# EAGLE design G2-CAPE (EAGLE 7.2.0)
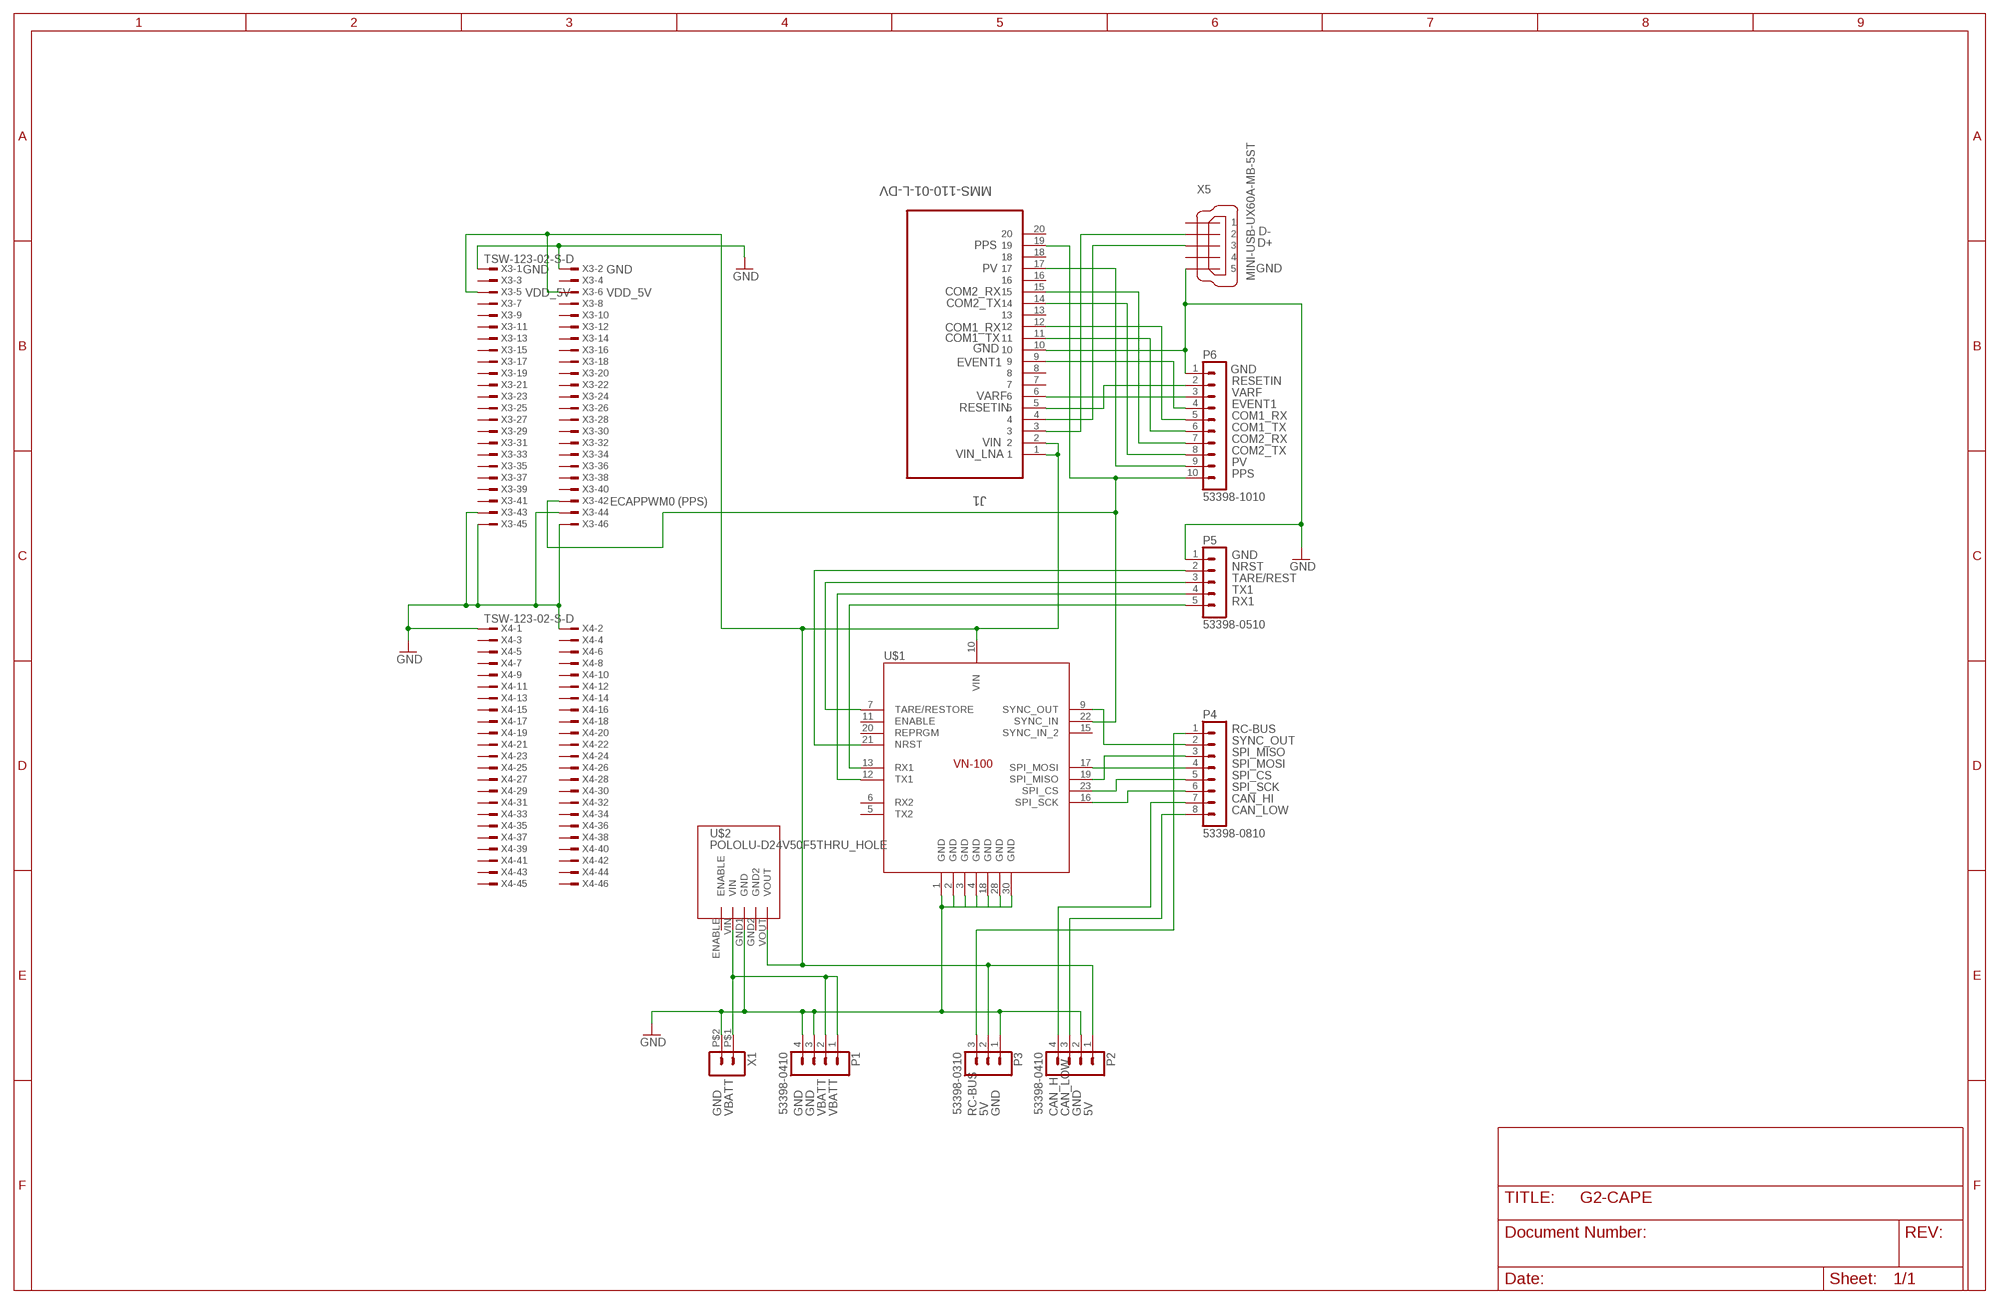
[diagram p0: schematic, sheet 1]

## Parts
J1  MMS-110-01-L-DV  [SAMTEC_MMS-110-01-L-DV]
P1  53398-0410  [53398-0410]
P2  53398-0410  [53398-0410]
P3  53398-0310  [53398-0310]
P4  53398-0810  [53398-0810]
P5  53398-0510  [53398-0510]
P6  53398-1010  [53398-1010]
U$1  VN100NORMAL  [7X8CASTLE]
U$2  POLOLU-D24V50F5THRU_HOLE  [POLOLU-D24V50F5]
X1  HEADER_POS2_  [43650-0203]
X3  TSW-123-02-S-D  [TSW-123-02-S-D]
X4  TSW-123-02-S-D  [TSW-123-02-S-D]
X5  MINI-USB-UX60A-MB-5ST  [UX60A-MB-5ST]

## Nets
GND: J1.10 P1.3 P1.4 P2.2 P3.1 P5.1 P6.1 U$1.1(GND) U$1.2(GND) U$1.3(GND) U$1.4(GND) U$1.18(GND) U$1.28(GND) U$1.30(GND) U$2.GND1(GND) X1.P$2 X3.1 X3.2 X3.43 X3.44 X3.45 X3.46 X4.1 X4.2 X5.5
N$1: P1.1 P1.2 U$2.VIN X1.P$1
N$2: J1.19 P6.10 U$1.22(SYNC_IN) X3.42
N$3: J1.1 J1.2 P2.1 P3.2 U$1.10(VIN) U$2.VOUT X3.5 X3.6
N$4: P5.5 U$1.13(RX1)
N$5: P3.3 P4.1
N$6: P2.3 P4.8
N$7: P2.4 P4.7
N$8: P5.4 U$1.12(TX1)
N$9: P4.2 U$1.9(SYNC_OUT)
N$10: P4.3 U$1.19(SPI_MISO)
N$11: P5.3 U$1.7(TARE/RESTORE)
N$12: P5.2 U$1.21(NRST)
N$13: J1.3 X5.2
N$14: P4.4 U$1.17(SPI_MOSI)
N$15: P4.5 U$1.23(SPI_CS)
N$16: P4.6 U$1.16(SPI_SCK)
N$20: J1.4 X5.3
N$21: J1.5 P6.2
N$23: J1.6 P6.3
N$24: J1.9 P6.4
N$25: J1.12 P6.5
N$26: J1.11 P6.6
N$27: J1.15 P6.7
N$28: J1.14 P6.8
N$29: J1.17 P6.9
Unconnected: J1.7 J1.8 J1.13 J1.16 J1.18 J1.20 U$1.5(TX2) U$1.6(RX2) U$1.11(ENABLE) U$1.15(SYNC_IN_2) U$1.20(REPRGM) U$2.ENABLE U$2.GND2 X3.3 X3.4 X3.7 X3.8 X3.9 X3.10 X3.11 X3.12 X3.13 X3.14 X3.15 X3.16 X3.17 X3.18 X3.19 X3.20 X3.21 X3.22 X3.23 X3.24 X3.25 X3.26 X3.27 X3.28 X3.29 X3.30 X3.31 X3.32 X3.33 X3.34 X3.35 X3.36 X3.37 X3.38 X3.39 X3.40 X3.41 X4.3 X4.4 X4.5 X4.6 X4.7 X4.8 X4.9 X4.10 X4.11 X4.12 X4.13 X4.14 X4.15 X4.16 X4.17 X4.18 X4.19 X4.20 X4.21 X4.22 X4.23 X4.24 X4.25 X4.26 X4.27 X4.28 X4.29 X4.30 X4.31 X4.32 X4.33 X4.34 X4.35 X4.36 X4.37 X4.38 X4.39 X4.40 X4.41 X4.42 X4.43 X4.44 X4.45 X4.46 X5.1 X5.4

## Notes on the sheet
- D-
- PPS | D+
- GND | GND | PV | GND
- VDD_5V | VDD_5V | COM2_RX
- COM2_TX
- COM1_RX
- COM1_TX
- GND
- EVENT1
- GND
- RESETIN
- VARF
- VARF
- EVENT1
- RESETIN
- COM1_RX
- COM1_TX
- COM2_RX
- VIN
- COM2_TX
- VIN_LNA
- PV
- PPS
- ECAPPWM0 (PPS)
- GND
- NRST
- TARE/REST
- TX1
- RX1
- RC-BUS
- SYNC_OUT
- SPI_MISO
- SPI_MOSI
- SPI_CS
- SPI_SCK
- CAN_HI
- CAN_LOW
- GND | VBATT | GND | GND | VBATT | VBATT | RC-BUS | 5V | GND | CAN_HI | CAN_LOW | GND | 5V

## Library data of the parts
J1 = SAMTEC-FLE-Mxx-Sxx_By_element14_Batch_1:MMS-110-01-L-DV: CONN RECEPTACLE, 2MM, VERT, 20WAY; MPN: MMS-110-01-L-DV; OC_FARNELL: 1667856; OC_NEWARK: 11P5392; PACKAGE: RECEPTACLE, 2MM, VERT, 20WAY; SUPPLIER: Samtec
P1 P2 = con-molex-picoblade:53398-0410: HEADER
P3 = con-molex-picoblade:53398-0310: HEADER
P4 = con-molex-picoblade:53398-0810: HEADER
P5 = con-molex-picoblade:53398-0510: HEADER
P6 = con-molex-picoblade:53398-1010: HEADER
U$1 = vectornav:VN100: VectorNav VN-100(T) Inertial Measurement Unit (IMU) and Attitude Heading Reference System (AHRS).
U$2 = pololu-D24V50F5:POLOLU-D24V50F5
X1 = con-molex-micro-fit-3_0:HEADER_POS2_?: Molex - Micro-Fit 3.0 Series connector, 3.00mm (0.118") pitch header, 2 positions.
X3 X4 = con-samtec:TSW-123-02-S-D: THROUGH-HOLE .025" SQ POST HEADER Source: Samtec TSW.pdf; OC_FARNELL: unknown; OC_NEWARK: unknown
X5 = con-hirose:MINI-USB-: MINI USB Connector Source: http://www.hirose.co.jp/cataloge_hp/e24000019.pdf; OC_FARNELL: unknown; OC_NEWARK: unknown

## Net classes
0 default: width 0.254 mm, drill 0.584 mm, clearance 0.254 mm

## Board
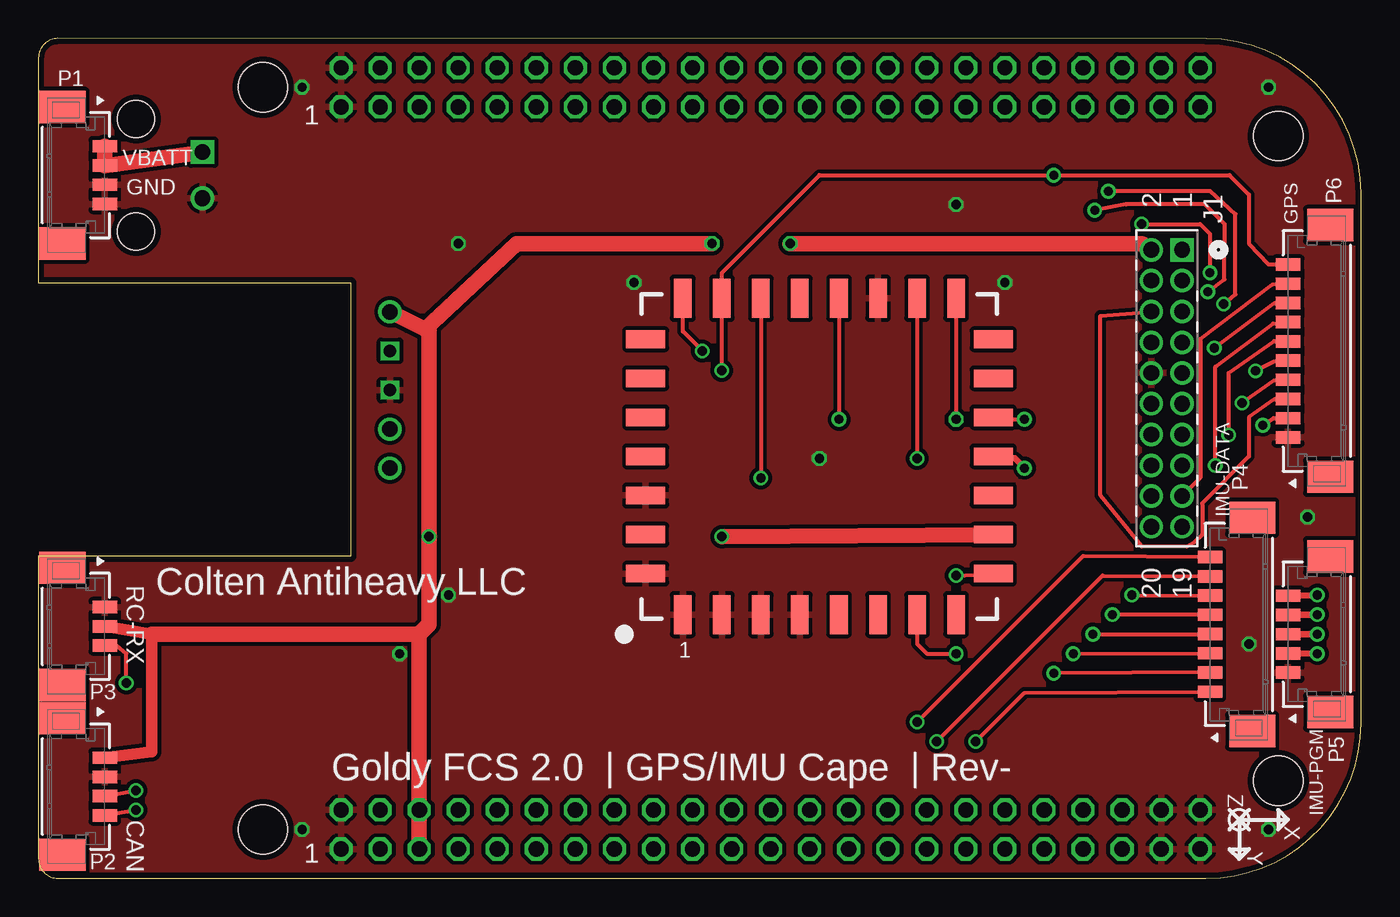
[diagram p1: board, top side]
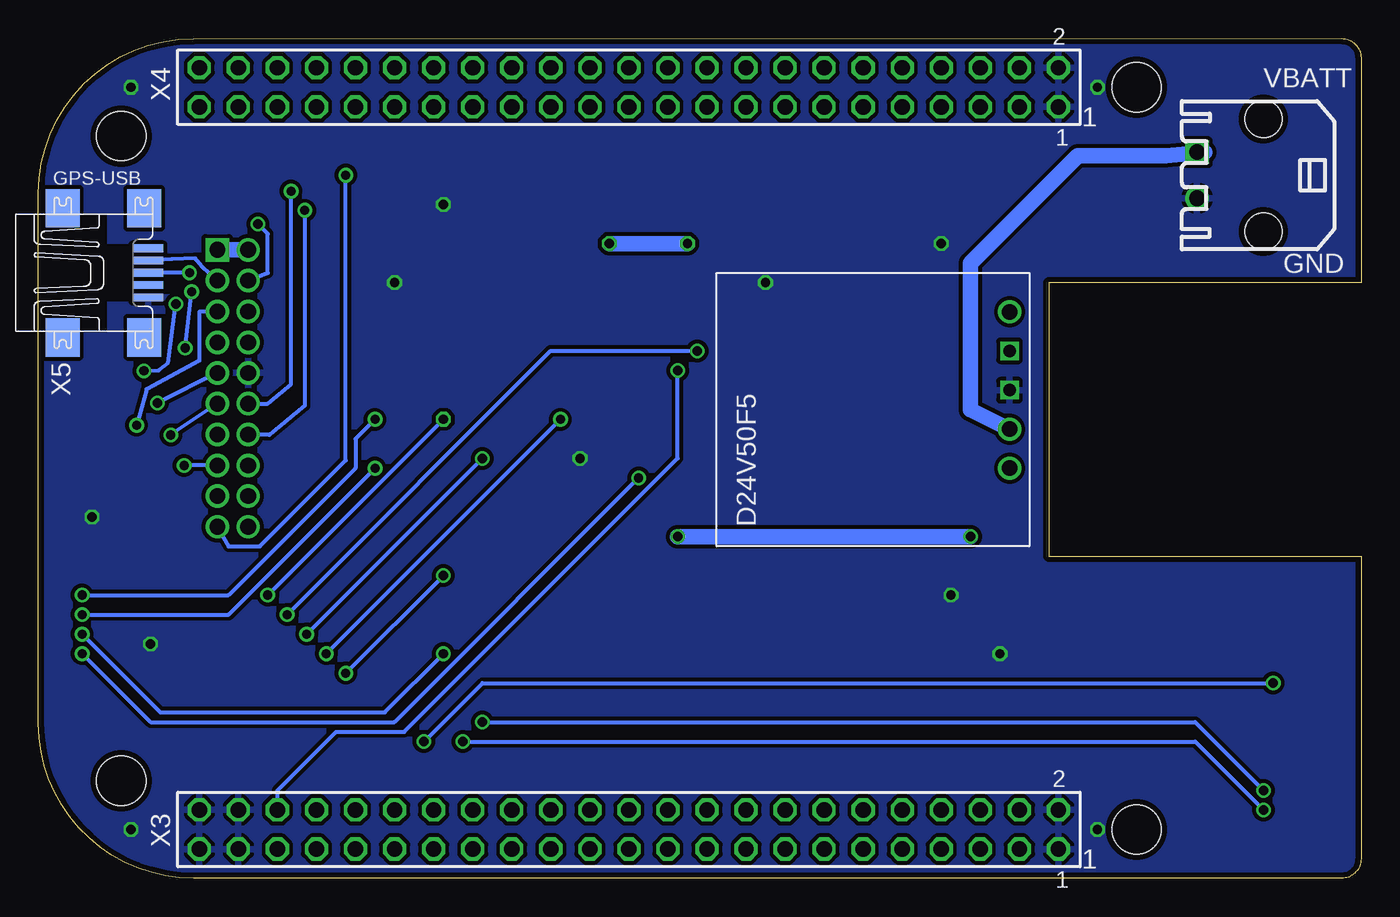
[diagram p2: board, bottom side, seen from below]

Size 86.03 x 54.61 mm. Coordinates in mm from the lower left corner, seen from the top.
Outline: 0,20.95 0,1.27 arc90 1.27,0 75.95,0 arc90 86.03,10.08 86.03,44.53 arc90 75.96,54.6 1.27,54.61 arc90 0,53.34 0,38.73 20.32,38.73 20.32,20.95 0,20.95
Copper layers (1*16): Top 0.0356mm / dielectric 1.5011mm / Bottom 0.0356mm
Design rules "oshpark-2layer *": minimum track width 6mil, minimum drill 13mil, track to track 6mil, track to pad 6mil, pad to pad 6mil, via to via 6mil, smd to smd 6mil, copper to edge 15mil, drill to drill 6mil, minimum pad ring 7mil, minimum via ring 7mil, stop-mask expansion 4mil, vias tented up to drill 25mil, thermal gap 10mil
Holes 3.2 mm at 14.61,3.17 14.61,51.44 80.64,6.35 80.64,48.26

### Footprints (pad centres in the part's own frame; a part is rotated, then mirrored left to right if it is on the bottom)
SAMTEC_MMS-110-01-L-DV = drill 1.016 square: 1 18.009,-2.007 | drill 1.016: 2 18.009,0; 3 16.002,-2.007; 4 16.002,0; 5 13.995,-2.007; 6 13.995,0; 7 11.989,-2.007; 8 11.989,0; 9 10.008,-2.007; 10 10.008,0; 11 8.001,-2.007; 12 8.001,0; 13 5.994,-2.007; 14 5.994,0; 15 3.988,-2.007; 16 3.988,0; 17 2.007,-2.007; 18 2.007,0; 19 0,-2.007; 20 0,0
53398-0410 = smd 0.8 x 1.6: 1 1.875,0; 2 0.625,0; 3 -0.625,0; 4 -1.875,0 | smd 2.1 x 3: M1 4.435,2.75; M2 -4.435,2.75
53398-0310 = smd 0.8 x 1.6: 1 1.25,0; 2 0,0; 3 -1.25,0 | smd 2.1 x 3: M1 3.81,2.75; M2 -3.81,2.75
53398-0810 = smd 0.8 x 1.6: 1 4.375,0; 2 3.125,0; 3 1.875,0; 4 0.625,0; 5 -0.625,0; 6 -1.875,0; 7 -3.125,0; 8 -4.375,0 | smd 2.1 x 3: M1 6.935,2.75; M2 -6.935,2.75
53398-0510 = smd 0.8 x 1.6: 1 2.5,0; 2 1.25,0; 3 0,0; 4 -1.25,0; 5 -2.5,0 | smd 2.1 x 3: M1 5.06,2.75; M2 -5.06,2.75
53398-1010 = smd 0.8 x 1.6: 1 5.625,0; 2 4.375,0; 3 3.125,0; 4 1.875,0; 5 0.625,0; 6 -0.625,0; 7 -1.875,0; 8 -3.125,0; 9 -4.375,0; 10 -5.625,0 | smd 2.1 x 3: M1 8.185,2.75; M2 -8.185,2.75
7X8CASTLE = smd 2.54 x 1.143: 1 10.16,-8.89; 2 10.16,-6.35; 3 10.16,-3.81; 4 10.16,-1.27; 5 10.16,1.27; 6 10.16,3.81; 7 10.16,6.35; 8 10.16,8.89; 16 -10.414,8.89; 17 -10.414,6.35; 18 -10.414,3.81; 19 -10.414,1.27; 20 -10.414,-1.27; 21 -10.414,-3.81; 22 -10.414,-6.35; 23 -10.414,-8.89 | smd 1.143 x 2.54: 9 7.493,11.303; 10 4.953,11.303; 11 2.413,11.303; 12 -0.127,11.303; 13 -2.667,11.303; 14 -5.207,11.303; 15 -7.747,11.303; 24 -7.747,-11.303; 25 -5.207,-11.303; 26 -2.667,-11.303; 27 -0.127,-11.303; 28 2.413,-11.303; 29 4.953,-11.303; 30 7.493,-11.303
POLOLU-D24V50F5 = drill 1: ENABLE 0,0; VIN 2.54,0; VOUT 10.16,0 | drill 0.8 square: GND1 5.08,0; GND2 7.62,0
43650-0203 = drill 1.02 square: P$1 1.5,4.32 | drill 1.02: P$2 -1.5,4.32 | hole 2.413: 3.658,0; -3.658,0
TSW-123-02-S-D = drill 1 pad 1.5 octagon: 1 27.94,-1.27; 2 27.94,1.27; 3 25.4,-1.27; 4 25.4,1.27; 5 22.86,-1.27; 6 22.86,1.27; 7 20.32,-1.27; 8 20.32,1.27; 9 17.78,-1.27; 10 17.78,1.27; 11 15.24,-1.27; 12 15.24,1.27; 13 12.7,-1.27; 14 12.7,1.27; 15 10.16,-1.27; 16 10.16,1.27; 17 7.62,-1.27; 18 7.62,1.27; 19 5.08,-1.27; 20 5.08,1.27; 21 2.54,-1.27; 22 2.54,1.27; 23 0,-1.27; 24 0,1.27; 25 -2.54,-1.27; 26 -2.54,1.27; 27 -5.08,-1.27; 28 -5.08,1.27; 29 -7.62,-1.27; 30 -7.62,1.27; 31 -10.16,-1.27; 32 -10.16,1.27; 33 -12.7,-1.27; 34 -12.7,1.27; 35 -15.24,-1.27; 36 -15.24,1.27; 37 -17.78,-1.27; 38 -17.78,1.27; 39 -20.32,-1.27; 40 -20.32,1.27; 41 -22.86,-1.27; 42 -22.86,1.27; 43 -25.4,-1.27; 44 -25.4,1.27; 45 -27.94,-1.27; 46 -27.94,1.27
UX60A-MB-5ST = smd 2 x 0.5: 1 2.25,1.6; 2 2.25,0.8; 3 2.25,0; 4 2.25,-0.8; 5 2.25,-1.6 | smd 2.2 x 2.5: M1 -3.3,-4.2; M2 -3.3,4.2; M3 2,4.2; M4 2,-4.2

### Placement (x,y rotation side)
J1  72.39,22.86 90 top
P1  4.32,45.72 90 top
P2  4.32,5.97 90 top
P3  4.32,16.38 90 top
P4  76.2,16.51 270 top
P5  81.28,15.88 270 top
P6  81.28,34.29 270 top
U$1  50.8,27.3 270 top
U$2  22.86,26.67 90 bottom
X1  6.35,45.72 90 bottom
X3  47.62,3.17 0 bottom
X4  47.62,51.44 0 bottom
X5  81.15,39.37 0 bottom

### Tracks (layer width: path | path; a pad name or v marks a point on that pad's centre or on a via)
GND  (via drill 0.6)
  other vias: 82.55,23.5 80.01,3.17 80.01,51.44 17.14,51.44 17.14,3.17 50.8,27.3 26.67,18.41 27.3,41.27 38.73,38.73 78.74,15.24 59.69,43.81 23.5,14.61 62.87,38.73
  pour Top: -1.27,55.88 -1.27,-1.27 87.63,-1.27 87.63,55.88
  pour Bottom: -1.27,55.88 87.63,55.88 87.63,-1.27 -1.27,-1.27
N$1
  Top 1.016: P1.1 P1.2 X1.P$1
  Bottom 0.61: 10.16,47.22 X1.P$1
  Bottom 1.016: U$2.VIN 25.4,30.48 25.4,40.01 18.41,46.99 12.7,46.99 10.16,47.22
N$2  (via drill 0.6)
  Top 0.254: P6.10 80.01,39.91 78.74,41.27 78.74,44.45 77.47,45.72 v66.04,45.72 50.8,45.72 44.45,39.37 U$1.22 v44.45,33.02
  Bottom 0.254: J1.19 73.66,21.59 71.63,21.59 66.04,27.18 v66.04,45.72 | X3.42 70.48,5.71 66.67,9.53 62.23,9.53 44.45,27.3 v44.45,33.02
N$3  (via drill 0.6)
  Top 0.762: P2.1 7.37,8.22 7.37,15.88 P3.2
  Top 1.016: 7.37,15.88 24.77,15.88 | 24.77,15.88 25.4,16.51 v25.4,22.23 25.4,35.56 25.15,35.69 | 25.15,35.69 U$2.VOUT | U$1.10 v44.45,22.23 | J1.2 71.75,41.27 v48.9,41.27 | v43.81,41.27 31.11,41.27 25.15,35.69 | X3.5 X3.6 24.77,15.88
  Bottom 1.016: J1.1 J1.2 | v25.4,22.23 v44.45,22.23 | v48.9,41.27 v43.81,41.27
N$4  (via drill 0.6)
  Top 0.254: 62.87,29.84 v64.14,29.84
  Top 0.406: P5.5 v83.19,18.41 | U$1.13 62.87,29.84
  Bottom 0.254: v83.19,18.41 73.66,18.41 65.41,26.67 65.41,28.57 v64.14,29.84
N$5  (via drill 0.6, 0.61)
  Top 0.254: v5.71,12.7 5.71,14.61 5.08,15.11 P3.3 | v60.96,8.89 64.14,12.06 P4.1
  Bottom 0.254: v5.71,12.7 57.15,12.7 v60.96,8.89
N$6  (via drill 0.6)
  Top 0.254: P2.3 v6.35,5.71 | v57.15,10.16 67.94,20.95 P4.8
  Bottom 0.254: v57.15,10.16 10.79,10.16 v6.35,5.71
N$7  (via drill 0.6)
  Top 0.254: P2.4 v6.35,4.45 | v58.42,8.89 69.22,19.68 P4.7
  Bottom 0.254: v58.42,8.89 10.79,8.89 v6.35,4.45
N$8  (via drill 0.6)
  Top 0.406: P5.4 v83.19,17.14 | U$1.12 63.5,27.3 v64.14,26.67
  Bottom 0.254: v83.19,17.14 73.66,17.14 v64.14,26.67
N$9  (via drill 0.6)
  Top 0.254: P4.2 v66.04,13.34 | v59.69,19.68 U$1.9
  Bottom 0.254: v66.04,13.34 v59.69,19.68
N$10  (via drill 0.6)
  Top 0.254: U$1.19 v52.07,29.84 | v67.31,14.61 P4.3
  Bottom 0.254: v52.07,29.84 v67.31,14.61
N$11  (via drill 0.6)
  Top 0.254: U$1.7 57.15,15.24 57.78,14.61 v59.69,14.61
  Top 0.406: P5.3 v83.19,15.88
  Bottom 0.254: v83.19,15.88 78.11,10.79 63.5,10.79 v59.69,14.61
N$12  (via drill 0.6)
  Top 0.254: U$1.21 v46.99,26.04
  Top 0.406: P5.2 v83.19,14.61
  Bottom 0.254: v83.19,14.61 78.74,10.16 62.87,10.16 v46.99,26.04
N$13
  Bottom 0.254: J1.3 75.39,39.78 75.84,40.31 77.34,40.26 X5.2
N$14  (via drill 0.6)
  Top 0.254: U$1.17 v57.15,27.3 | v68.58,15.88 P4.4
  Bottom 0.254: v57.15,27.3 v68.58,15.88
N$15  (via drill 0.6)
  Top 0.254: P4.5 v69.85,17.14 | v43.18,34.29 41.91,35.56 U$1.23
  Bottom 0.254: v69.85,17.14 52.7,34.29 v43.18,34.29
N$16  (via drill 0.6)
  Top 0.254: U$1.16 v59.69,29.84 | v71.12,18.41 P4.6
  Bottom 0.254: v59.69,29.84 v71.12,18.41
N$20  (via drill 0.6)
  Top 0.254: v71.75,42.55 75.56,42.55 76.2,41.91 v76.2,39.37
  Bottom 0.254: J1.4 71.12,39.37 71.12,41.91 v71.75,42.55 | v76.2,39.37 X5.3
N$21  (via drill 0.6)
  Top 0.254: v79.64,29.46 80.34,29.92 P6.2
  Bottom 0.254: J1.5 75.56,36.83 75.56,33.66 78.99,31.8 v79.64,29.46
N$23
  Top 0.254: P6.3 80.39,31.14 78.74,29.97 78.74,27.43 75.69,24.38 75.69,22.35 75.18,21.84 74.68,21.57 71.75,21.59 69.09,24.89 69.09,36.58 J1.6
N$24  (via drill 0.6)
  Top 0.254: v78.28,30.91 80.37,32.38 P6.4
  Bottom 0.254: J1.9 v78.28,30.91
N$25  (via drill 0.6)
  Top 0.254: v69.6,44.68 70.1,44.7 76.2,44.7 77.85,43.18 77.85,37.97 v77.09,37.34 | P6.5 80.37,33.6 v79.17,32.99
  Bottom 0.254: J1.12 71.12,30.86 69.6,32.13 v69.6,44.68 | v79.17,32.99 78.23,33.02 77.6,33.53 v77.09,37.34
N$26  (via drill 0.6)
  Top 0.254: v77.42,28.83 77.42,32.87 80.37,34.92 P6.6
  Bottom 0.254: J1.11 v77.42,28.83
N$27  (via drill 0.6)
  Top 0.254: v76.56,26.85 76.56,33.27 80.29,36.07 P6.7
  Bottom 0.254: J1.15 v76.56,26.85
N$28  (via drill 0.6)
  Top 0.254: P6.8 80.69,37.41 80.39,37.39 v76.48,34.48 | v76.06,38.14 77.14,38.94 77.15,42.55 75.88,43.81 70.74,43.81 v68.71,43.43
  Bottom 0.254: v76.48,34.48 v76.06,38.14 | v68.71,43.43 68.71,30.73 70.99,28.83 J1.14
N$29
  Top 0.254: P6.9 80.26,38.61 75.56,35.05 75.56,26.04 J1.17

### Text on the board
_tsilk: 1 | VBATT | GND | GPS | IMU-DATA | RC-RX | Colten Antiheavy LLC | 1 | Goldy FCS 2.0 | GPS/IMU Cape | Rev- | Z | CAN | IMU-PGM | X | Y | 1
_bsilk: VBATT | 1 | GPS-USB | GND | 1